# Altium schematic sheet P17_LVDS LCD.SchDoc
size 420 x 297 mm
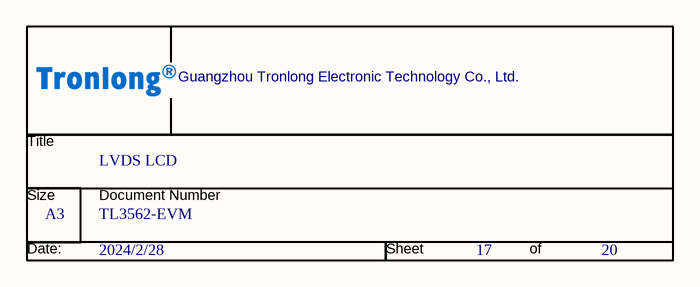
[diagram p0: P17_LVDS LCD.SchDoc]

## Parts
*  Page Count: 20  Page Number: 17  Page Size: A3  OrgName: Guangzhou Tronlong Electronic Technology Co., Ltd.  Title: LVDS LCD  Doc: TL3562-EVM  Page Modify Date: 2024/2/28  (hidden comment: Tronlong_TITTLE_20211115)  (graphical)

## Notes on the sheet
- (in symbol Tronlong_TITTLE_20211115) Title; Size; Document Number; Date:; Sheet; of

## Library data of the parts
* = Tronlong_TITTLE_20211115: RevCode: A?; Page Create Date: March  8, 1995